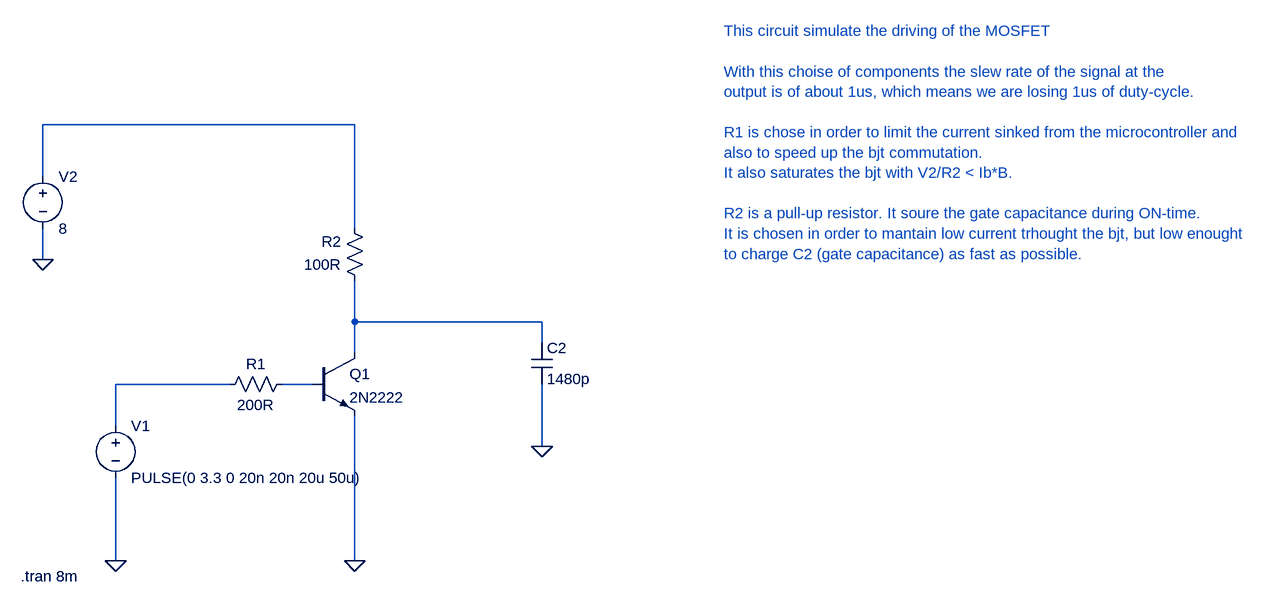
[diagram p0: schematic mosfet-driver.asc]
mosfet-driver.asc, the LTspice schematic file:
Version 4
SHEET 1 1816 680
WIRE 336 -224 -144 -224
WIRE -144 -144 -144 -224
WIRE 336 -64 336 -224
WIRE -144 -16 -144 -64
WIRE 336 80 336 16
WIRE 624 80 336 80
WIRE 624 112 624 80
WIRE 336 128 336 80
WIRE 144 176 -32 176
WIRE 272 176 224 176
WIRE -32 240 -32 176
WIRE 624 272 624 176
WIRE -32 448 -32 320
WIRE 336 448 336 224
FLAG -32 448 0
FLAG 336 448 0
FLAG -144 -16 0
FLAG 624 272 0
SYMBOL npn 272 128 R0
SYMATTR InstName Q1
SYMATTR Value 2N2222
SYMBOL voltage -32 224 R0
WINDOW 123 0 0 Left 0
WINDOW 39 0 0 Left 0
SYMATTR InstName V1
SYMATTR Value PULSE(0 3.3 0 20n 20n 20u 50u)
SYMBOL res 240 160 R90
WINDOW 0 0 56 VBottom 2
WINDOW 3 32 56 VTop 2
SYMATTR InstName R1
SYMATTR Value 200R
SYMBOL voltage -144 -160 R0
WINDOW 123 0 0 Left 0
WINDOW 39 0 0 Left 0
SYMATTR InstName V2
SYMATTR Value 8
SYMBOL cap 608 112 R0
SYMATTR InstName C2
SYMATTR Value 1480p
SYMBOL res 352 32 R180
WINDOW 0 36 76 Left 2
WINDOW 3 36 40 Left 2
SYMATTR InstName R2
SYMATTR Value 100R
TEXT -178 472 Left 2 !.tran 8m
TEXT 904 -368 Left 2 ;This circuit simulate the driving of the MOSFET\n \nWith this choise of components the slew rate of the signal at the \noutput is of about 1us, which means we are losing 1us of duty-cycle.\n \nR1 is chose in order to limit the current sinked from the microcontroller and \nalso to speed up the bjt commutation.\nIt also saturates the bjt with V2/R2 < Ib*B.\n \nR2 is a pull-up resistor. It soure the gate capacitance during ON-time.\nIt is chosen in order to mantain low current trhought the bjt, but low enought \nto charge C2 (gate capacitance) as fast as possible.

The netlist it stands for:
* mosfet-driver.asc
Q1 N002 N004 0 0 2N2222
V1 N003 0 PULSE(0 3.3 0 20n 20n 20u 50u)
R1 N004 N003 200R
V2 N001 0 8
C2 N002 0 1480p
R2 N002 N001 100R
.model NPN NPN
.model PNP PNP
.lib standard.bjt
.tran 8m
* This circuit simulate the driving of the MOSFET
* With this choise of components the slew rate of the signal at the
* output is of about 1us, which means we are losing 1us of duty-cycle.
* R1 is chose in order to limit the current sinked from the microcontroller and
* also to speed up the bjt commutation.
* It also saturates the bjt with V2/R2 < Ib*B.
* R2 is a pull-up resistor. It soure the gate capacitance during ON-time.
* It is chosen in order to mantain low current trhought the bjt, but low enought
* to charge C2 (gate capacitance) as fast as possible.
.backanno
.end